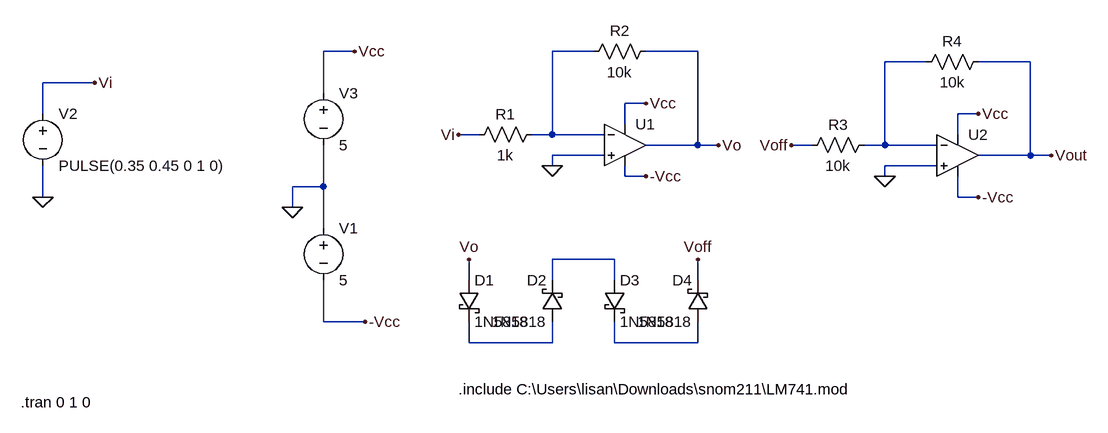
[diagram p0: schematic Draft2.asc]
Draft2.asc, the LTspice schematic file:
Version 4
SHEET 1 984 680
WIRE -160 -32 -208 -32
WIRE 208 -32 144 -32
WIRE 368 -32 288 -32
WIRE 720 -16 656 -16
WIRE 880 -16 800 -16
WIRE -560 16 -640 16
WIRE -208 32 -208 -32
WIRE 288 48 256 48
WIRE -640 64 -640 16
WIRE 800 64 768 64
WIRE 256 80 256 48
WIRE 32 96 0 96
WIRE 144 96 144 -32
WIRE 144 96 112 96
WIRE 224 96 144 96
WIRE 768 96 768 64
WIRE 368 112 368 -32
WIRE 368 112 288 112
WIRE 400 112 368 112
WIRE 544 112 512 112
WIRE 656 112 656 -16
WIRE 656 112 624 112
WIRE 736 112 656 112
WIRE 224 128 144 128
WIRE 880 128 880 -16
WIRE 880 128 800 128
WIRE 912 128 880 128
WIRE 144 144 144 128
WIRE 736 144 656 144
WIRE 256 160 256 144
WIRE 288 160 256 160
WIRE 656 160 656 144
WIRE -208 176 -208 112
WIRE -208 176 -256 176
WIRE -640 192 -640 144
WIRE 768 192 768 160
WIRE 800 192 768 192
WIRE -256 208 -256 176
WIRE -208 240 -208 176
WIRE 240 288 144 288
WIRE 16 320 16 288
WIRE 144 320 144 288
WIRE 240 320 240 288
WIRE 368 320 368 288
WIRE -208 384 -208 320
WIRE -144 384 -208 384
WIRE 16 416 16 384
WIRE 144 416 144 384
WIRE 144 416 16 416
WIRE 240 416 240 384
WIRE 368 416 368 384
WIRE 368 416 240 416
FLAG 144 144 0
FLAG 0 96 Vi
FLAG 400 112 Vo
FLAG 16 288 Vo
FLAG 368 288 Voff
FLAG 288 48 Vcc
FLAG -640 192 0
FLAG -560 16 Vi
FLAG 656 160 0
FLAG 512 112 Voff
FLAG 912 128 Vout
FLAG 800 64 Vcc
FLAG -256 208 0
FLAG -160 -32 Vcc
FLAG -144 384 -Vcc
FLAG 288 160 -Vcc
FLAG 800 192 -Vcc
SYMBOL res 128 80 R90
WINDOW 0 0 56 VBottom 2
WINDOW 3 32 56 VTop 2
SYMATTR InstName R1
SYMATTR Value 1k
SYMBOL res 304 -48 R90
WINDOW 0 0 56 VBottom 2
WINDOW 3 32 56 VTop 2
SYMATTR InstName R2
SYMATTR Value 10k
SYMBOL schottky 0 320 R0
SYMATTR InstName D1
SYMATTR Value 1N5818
SYMATTR Description Diode
SYMATTR Type diode
SYMBOL schottky 160 384 R180
WINDOW 0 24 64 Left 2
WINDOW 3 24 0 Left 2
SYMATTR InstName D2
SYMATTR Value 1N5818
SYMATTR Description Diode
SYMATTR Type diode
SYMBOL schottky 224 320 R0
SYMATTR InstName D3
SYMATTR Value 1N5818
SYMATTR Description Diode
SYMATTR Type diode
SYMBOL schottky 384 384 R180
WINDOW 0 24 64 Left 2
WINDOW 3 24 0 Left 2
SYMATTR InstName D4
SYMATTR Value 1N5818
SYMATTR Description Diode
SYMATTR Type diode
SYMBOL voltage -640 48 R0
WINDOW 123 0 0 Left 0
WINDOW 39 0 0 Left 0
SYMATTR InstName V2
SYMATTR Value PULSE(0.35 0.45 0 1 0)
SYMBOL res 640 96 R90
WINDOW 0 0 56 VBottom 2
WINDOW 3 32 56 VTop 2
SYMATTR InstName R3
SYMATTR Value 10k
SYMBOL res 816 -32 R90
WINDOW 0 0 56 VBottom 2
WINDOW 3 32 56 VTop 2
SYMATTR InstName R4
SYMATTR Value 10k
SYMBOL Opamps\\UniversalOpamp2 256 112 R0
SYMATTR InstName U1
SYMBOL Opamps\\UniversalOpamp2 768 128 R0
SYMATTR InstName U2
SYMBOL voltage -208 224 R0
WINDOW 123 0 0 Left 0
WINDOW 39 0 0 Left 0
SYMATTR InstName V1
SYMATTR Value 5
SYMBOL voltage -208 16 R0
WINDOW 123 0 0 Left 0
WINDOW 39 0 0 Left 0
SYMATTR InstName V3
SYMATTR Value 5
TEXT 0 488 Left 2 !.include C:\\Users\\lisan\\Downloads\\snom211\\LM741.mod
TEXT -674 508 Left 2 !.tran 0 1 0

The netlist it stands for:
* Draft2.asc
R1 N001 Vi 1k
R2 Vo N001 10k
D1 Vo N004 1N5818
D2 N004 N003 1N5818
D3 N003 N005 1N5818
D4 N005 Voff 1N5818
V2 Vi 0 PULSE(0.35 0.45 0 1 0)
R3 N002 Voff 10k
R4 Vout N002 10k
XU1 0 N001 Vcc -Vcc Vo level.2 Avol=1Meg GBW=10Meg Slew=10Meg ilimit=25m rail=0 Vos=0 phimargin=45 en=0 enk=0 in=0 ink=0 Rin=500Meg  ; pins IN+ IN- V+ V- OUT
XU2 0 N002 Vcc -Vcc Vout level.2 Avol=1Meg GBW=10Meg Slew=10Meg ilimit=25m rail=0 Vos=0 phimargin=45 en=0 enk=0 in=0 ink=0 Rin=500Meg  ; pins IN+ IN- V+ V- OUT
V1 0 -Vcc 5
V3 Vcc 0 5
.model D D
.lib standard.dio
.include C:\Users\lisan\Downloads\snom211\LM741.mod
.tran 0 1 0
.lib UniversalOpamps2.sub
.backanno
.end